# Altium project Creating and Using Design Reuse Block in a Workspace - Brendan Cook.PrjPcb (part 1 of 2)
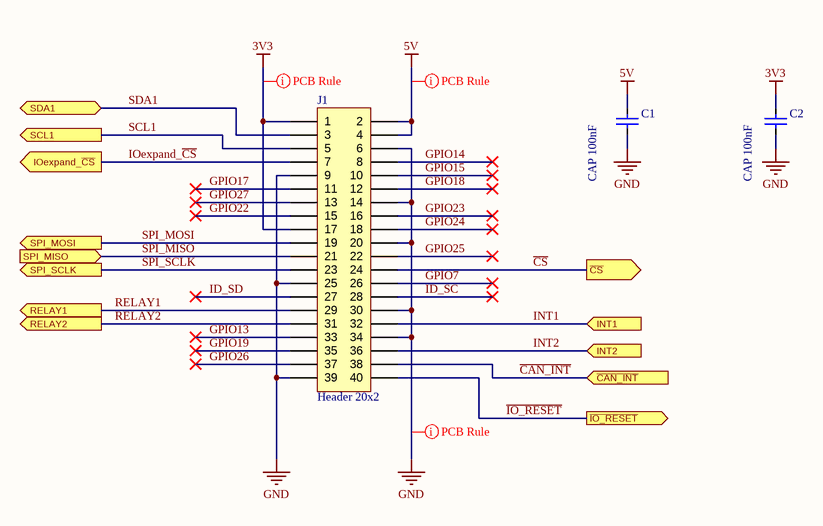
[diagram p0:  Processor_Interface.SchDoc]
 Altium Department: Altium Training Department;  Altium Training: Altium Designer Essentials Training Course - A365;  Altium Training Module: Module [--] / [Title];  CAGE_CODE: -----;  CONTRACT_NUMBER: <CONTRACT NO>;  DOC_NO_ASSY_DWG: <ASSY DWG NO>;  DOC_NO_BOM: <BOM DOC NO>;  DOC_NO_FAB_DWG: <FAB DWG NO>;  DOC_NO_SCH_DWG: <SCH DWG NO>;  DRAFTSMAN_ASSEMBLY_SCALE: 1:1;  DRAFTSMAN_FABRICATION_SCALE: 1:1;  PCB_2_DEC_TOL: +/-.01;  PCB_3_DEC_TOL: +/-.010;  PCB_ANG_TOL: +/-1/2;  PCB_ASSEMBLY_NO: <PCB ASSY NO>;  PCB_CHECKER: - -----;  PCB_CHECKER_APP_DATE: --/--/----;  PCB_DESIGNER: - -----;  PCB_DESIGNER_APP_DATE: --/--/----;  PCB_DWG_NO: A-ET-A365-001;  PCB_ENGINEER: - -----;  PCB_ENGINEER_APP_DATE: --/--/----;  PCB_PART_NUMBER: <PCB PN>;  PCB_REV: 1.0;  PCB_SCALE: NONE;  PCB_TITLE_1: <TITLE 1>;  PCB_TITLE_2: <TITLE 2>;  Project_Name: WC Topping;  SCH_CHECKER: - -----;  SCH_CHECKER_APP_DATE: --/--/----;  SCH_DESIGNER: - -----;  SCH_DESIGNER_APP_DATE: --/--/----;  SCH_ENGINEER: - -----;  SCH_ENGINEER_APP_DATE: --/--/----;  SCH_REV: A
8 sheets, 53 parts. Net scope: hierarchical (ports join the sheet entries above them; power ports are global).
Board file:  Creating and Using Design Reuse Block in a Workspace.PcbDoc
Sheets:
   Processor_Interface.SchDoc
   IO Logic Block.SchDoc
   Processor_Power.SchDoc
   CAN_Interface.SchDoc
   Digital_ IO.SchDoc
   Relay_IO.SchDoc
   Top_Level.SchDoc
   Power Supply.SchDoc

## Sheet  Processor_Interface.SchDoc
size 431 x 279 mm; Organization: ORGANIZATION; Address1: ADDRESS 1; Address2: ADDRESS 2; Address3: ADDRESS 3; Address4: ADDRESS 4; Revision: -; SheetNumber: 7; SheetTotal: 8; ENG_APP_DATE: --/--/--; DSN_APP_DATE: --/--/--; CHK_APP_DATE: --/--/--

### Parts
C1  CAP 100nF  [0603C_L]
C2  CAP 100nF  [0603C_L]
J1  Header 20x2  [HDR2X20]

### Ports
INT1 (in), INT2 (in), IOexpand_~{CS} (out), RELAY1 (out), RELAY2 (out), SCL1 (out), SDA1 (bidir), SPI_MISO (in), SPI_MOSI (out), SPI_SCLK (out), ~{CAN_INT} (in), ~{CS} (out), ~{IO_RESET} (out)

### Nets
3V3: C2.2 J1.1 J1.17
5V: C1.2 J1.2 J1.4
GND: C1.1 C2.1 J1.6 J1.9 J1.14 J1.20 J1.25 J1.30 J1.34 J1.39
~{CAN_INT}: J1.38 ; port ~{CAN_INT}
~{IO_RESET}: J1.40 ; port ~{IO_RESET}
~{CS}: J1.24 ; port ~{CS}
GPIO7: J1.26
GPIO13: J1.33
GPIO14: J1.8
GPIO15: J1.10
GPIO17: J1.11
GPIO18: J1.12
GPIO19: J1.35
GPIO22: J1.15
GPIO23: J1.16
GPIO24: J1.18
GPIO25: J1.22
GPIO26: J1.37
GPIO27: J1.13
ID_SC: J1.28
ID_SD: J1.27
INT1: J1.32 ; port INT1
INT2: J1.36 ; port INT2
IOexpand_~{CS}: J1.7 ; port IOexpand_~{CS}
RELAY1: J1.29 ; port RELAY1
RELAY2: J1.31 ; port RELAY2
SCL1: J1.5 ; port SCL1
SDA1: J1.3 ; port SDA1
SPI_MISO: J1.21 ; port SPI_MISO
SPI_MOSI: J1.19 ; port SPI_MOSI
SPI_SCLK: J1.23 ; port SPI_SCLK

### Layout directives
net class Power; rule Width Constraint [Pref Width = 30mil    Min Width = 10mil    Max Width = 100mil]: 3V3, 5V, GND

### Notes on the sheet
- DWG. NO.
- REV.
- SHT.
- THIS DOCUMENT AND THE DATA DISCLOSED HEREIN OR HEREWITH IS THE PROPERTY OF ALTIUM LIMITED AND MAY BE FREELY DISTRIBUTED IN WHOLE. NO RIGHTS ARE RESERVED OR EXPRESS OR IMPLIED WARANTEE GIVEN.
- REVISION
- DESCRIPTION
- DATE
- APPROVED
- ENG:
- DSN:
- APPROVALS
- PROJECT REVISION:
- www.altium.com <http://www.altium.com>
- DOCUMENT REVISION:
- 92037, La Jolla
- USA
- Altium Ltd.
- 4225 Executive Square
- CHK:
- REFERENCE DOCUMENTS
- DESIGN ITEM:
- TITLE
- VARIANT
- BOM:
- FAB DWG:
- PCB DWG:
- ASSY DWG:
- SCALE:
- SIZE
- B
- CAGE CODE
- FILE NAME
- DWG NO.
- SHEET
- OF
- REV

### Library data of the parts
C1 C2 = CMP-001-00091-2: Ceramic Capacitor, Multilayer, Ceramic, 50V, 80% +Tol, 20% -Tol, Y5V, -82/+22% TC, 0.1uF, Surface Mount, 0603; Manufacturer: Yageo; Manufacturer Part Number: CC0603ZRY5V9BB104; Multilayer: Yes; Packaging: Tape and Reel; Case/Package: 0603; Dielectric Material: Ceramic; Height: 0.8mm; Length: 1.6mm; Max Operating Temperature: 85°C; Min Operating Temperature: -30°C; Mounting Technology: Surface Mount; Pins: 2; RoHS Compliant: Yes; Termination: Wraparound; Value: 100nF; Voltage Rating: 50V; Width: 0.8mm; Capacitor Type: Ceramic; JESD-609 Code: e3; Package Shape: Rectangular; Package Style: SMTMeter; Rated DC Voltage (URdc): 50V; Reach SVHC Compliant: Yes; Temperature Characteristics Code: Y5V; Terminal Finish: Nickel; Tolerance  (fill in as +-): 20%; Tolerance (fill in as +-): 80%; Component Type: Capacitors; Design Item ID: CMP-00119-2; Source: WCTopping - Master Project 2023-08-21.SCHLIB
J1 = CMP-002-00076-2: Header, 20-Pin, Dual row; LatestRevisionDate: 17-Jul-2002; LatestRevisionNote: Re-released for DXP Platform.; Publisher: Altium Limited; Design Item ID: Header 20X2; Source: WCT.SchLib; Component Type: Connectors; Pins: 40

## Sheet  IO Logic Block.SchDoc
size 431 x 279 mm; Organization: ORGANIZATION; Address1: ADDRESS 1; Address2: ADDRESS 2; Address3: ADDRESS 3; Address4: ADDRESS 4; Revision: -; SheetNumber: 2; SheetTotal: 8; ENG_APP_DATE: --/--/--; DSN_APP_DATE: --/--/--; CHK_APP_DATE: --/--/--
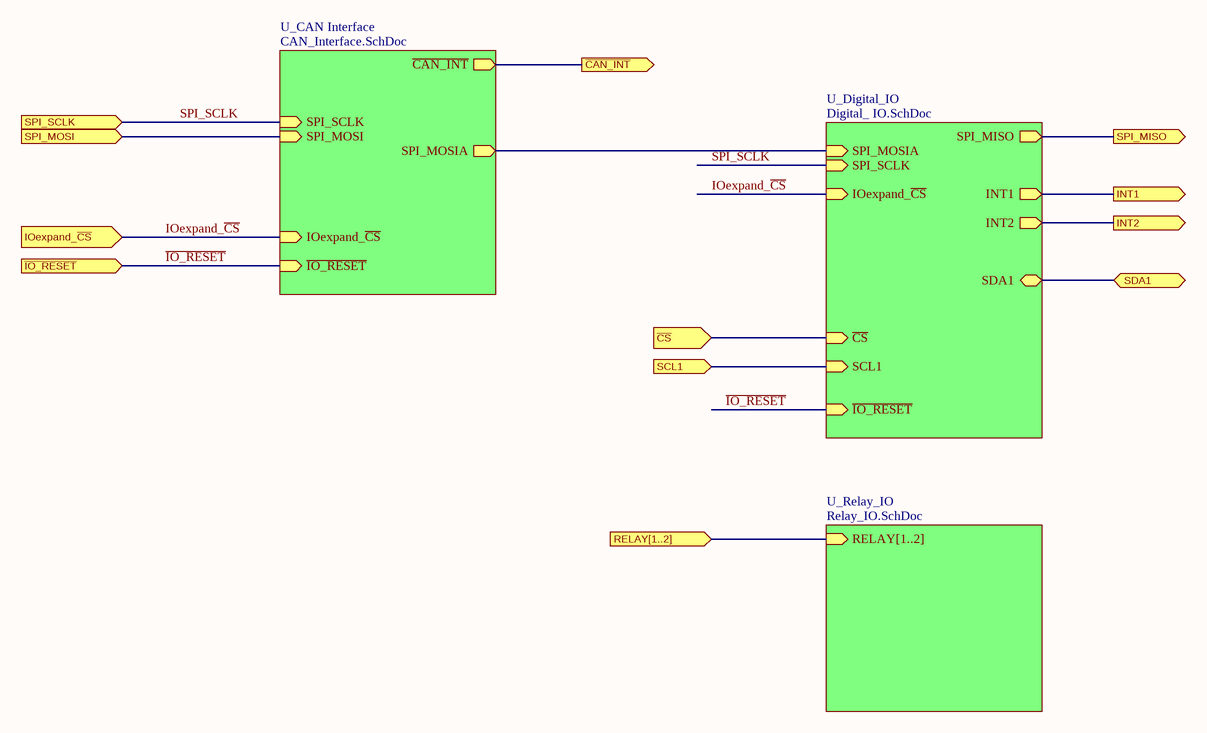
[diagram p1:  IO Logic Block.SchDoc]

### Sub-sheets
U_CAN Interface = CAN_Interface.SchDoc (file not in this document): ~{CAN_INT} (out), SPI_SCLK (in), SPI_MOSI (in), SPI_MOSIA (out), ~{IO_RESET} (in), IOexpand_~{CS} (in)
U_Digital_IO = Digital_ IO.SchDoc (file not in this document): IOexpand_~{CS} (in), SPI_SCLK (in), SPI_MOSIA (in), SPI_MISO (out), ~{IO_RESET} (in), INT1 (out), INT2 (out), ~{CS} (in), SDA1 (bidir), SCL1 (in)
U_Relay_IO = Relay_IO.SchDoc (file not in this document): RELAY[1..2] (in)

### Ports
INT1 (out), INT2 (out), IOexpand_~{CS} (in), RELAY[1..2] (in), SCL1 (in), SDA1 (bidir), SPI_MISO (out), SPI_MOSI (in), SPI_SCLK (in), ~{CAN_INT} (out), ~{CS} (in), ~{IO_RESET} (in)

### Nets
~{IO_RESET}: port ~{IO_RESET}, sheet U_Digital_IO/~{IO_RESET}, sheet U_CAN Interface/~{IO_RESET}
IOexpand_~{CS}: port IOexpand_~{CS}, sheet U_Digital_IO/IOexpand_~{CS}, sheet U_CAN Interface/IOexpand_~{CS}
SPI_SCLK: port SPI_SCLK, sheet U_Digital_IO/SPI_SCLK, sheet U_CAN Interface/SPI_SCLK
(unnamed): port ~{CAN_INT}, sheet U_CAN Interface/~{CAN_INT}
(unnamed): port SPI_MOSI, sheet U_CAN Interface/SPI_MOSI
(unnamed): port SPI_MISO, sheet U_Digital_IO/SPI_MISO
(unnamed): port INT1, sheet U_Digital_IO/INT1
(unnamed): port INT2, sheet U_Digital_IO/INT2
(unnamed): port SDA1, sheet U_Digital_IO/SDA1
(unnamed): port SCL1, sheet U_Digital_IO/SCL1
(unnamed): port ~{CS}, sheet U_Digital_IO/~{CS}
(unnamed): sheet U_Digital_IO/SPI_MOSIA, sheet U_CAN Interface/SPI_MOSIA

### Buses and harness runs
bus port RELAY[1..2] = sheet U_Relay_IO/RELAY[1..2]

### Notes on the sheet
- DWG. NO.
- REV.
- SHT.
- THIS DOCUMENT AND THE DATA DISCLOSED HEREIN OR HEREWITH IS THE PROPERTY OF ALTIUM LIMITED AND MAY BE FREELY DISTRIBUTED IN WHOLE. NO RIGHTS ARE RESERVED OR EXPRESS OR IMPLIED WARANTEE GIVEN.
- REVISION
- DESCRIPTION
- DATE
- APPROVED
- ENG:
- DSN:
- APPROVALS
- PROJECT REVISION:
- www.altium.com <http://www.altium.com>
- DOCUMENT REVISION:
- 92037, La Jolla
- USA
- Altium Ltd.
- 4225 Executive Square
- CHK:
- REFERENCE DOCUMENTS
- DESIGN ITEM:
- TITLE
- VARIANT
- BOM:
- FAB DWG:
- PCB DWG:
- ASSY DWG:
- SCALE:
- SIZE
- B
- CAGE CODE
- FILE NAME
- DWG NO.
- SHEET
- OF
- REV

## Sheet  Processor_Power.SchDoc
size 431 x 279 mm; Organization: ORGANIZATION; Address1: ADDRESS 1; Address2: ADDRESS 2; Address3: ADDRESS 3; Address4: ADDRESS 4; Revision: -; SheetNumber: 6; SheetTotal: 8; ENG_APP_DATE: --/--/--; DSN_APP_DATE: --/--/--; CHK_APP_DATE: --/--/--
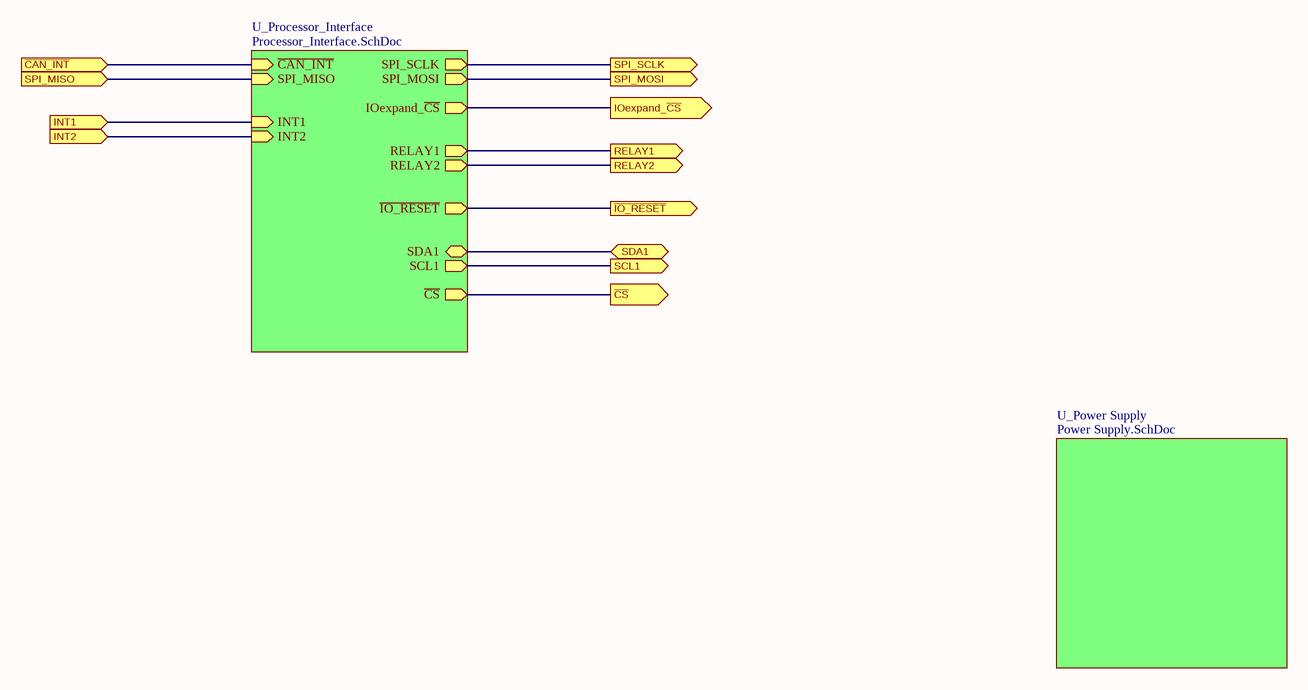
[diagram p2:  Processor_Power.SchDoc]

### Sub-sheets
U_Power Supply = Power Supply.SchDoc (file not in this document): no entries
U_Processor_Interface = Processor_Interface.SchDoc (file not in this document): ~{CAN_INT} (in), SPI_SCLK (out), SPI_MOSI (out), SPI_MISO (in), IOexpand_~{CS} (out), RELAY1 (out), RELAY2 (out), INT1 (in), INT2 (in), ~{IO_RESET} (out), SDA1 (bidir), SCL1 (out), ~{CS} (out)

### Ports
INT1 (in), INT2 (in), IOexpand_~{CS} (out), RELAY1 (out), RELAY2 (out), SCL1 (out), SDA1 (bidir), SPI_MISO (in), SPI_MOSI (out), SPI_SCLK (out), ~{CAN_INT} (in), ~{CS} (out), ~{IO_RESET} (out)

### Nets
(unnamed): port SDA1, sheet U_Processor_Interface/SDA1
(unnamed): port SCL1, sheet U_Processor_Interface/SCL1
(unnamed): port IOexpand_~{CS}, sheet U_Processor_Interface/IOexpand_~{CS}
(unnamed): port SPI_MOSI, sheet U_Processor_Interface/SPI_MOSI
(unnamed): port SPI_MISO, sheet U_Processor_Interface/SPI_MISO
(unnamed): port SPI_SCLK, sheet U_Processor_Interface/SPI_SCLK
(unnamed): port ~{CS}, sheet U_Processor_Interface/~{CS}
(unnamed): port RELAY1, sheet U_Processor_Interface/RELAY1
(unnamed): port INT1, sheet U_Processor_Interface/INT1
(unnamed): port RELAY2, sheet U_Processor_Interface/RELAY2
(unnamed): port INT2, sheet U_Processor_Interface/INT2
(unnamed): port ~{IO_RESET}, sheet U_Processor_Interface/~{IO_RESET}
(unnamed): port ~{CAN_INT}, sheet U_Processor_Interface/~{CAN_INT}

### Notes on the sheet
- DWG. NO.
- REV.
- SHT.
- THIS DOCUMENT AND THE DATA DISCLOSED HEREIN OR HEREWITH IS THE PROPERTY OF ALTIUM LIMITED AND MAY BE FREELY DISTRIBUTED IN WHOLE. NO RIGHTS ARE RESERVED OR EXPRESS OR IMPLIED WARANTEE GIVEN.
- REVISION
- DESCRIPTION
- DATE
- APPROVED
- ENG:
- DSN:
- APPROVALS
- PROJECT REVISION:
- www.altium.com <http://www.altium.com>
- DOCUMENT REVISION:
- 92037, La Jolla
- USA
- Altium Ltd.
- 4225 Executive Square
- CHK:
- REFERENCE DOCUMENTS
- DESIGN ITEM:
- TITLE
- VARIANT
- BOM:
- FAB DWG:
- PCB DWG:
- ASSY DWG:
- SCALE:
- SIZE
- B
- CAGE CODE
- FILE NAME
- DWG NO.
- SHEET
- OF
- REV

## Sheet  CAN_Interface.SchDoc
size 431 x 279 mm; Organization: ORGANIZATION; Address1: ADDRESS 1; Address2: ADDRESS 2; Address3: ADDRESS 3; Address4: ADDRESS 4; Revision: -; SheetNumber: 3; SheetTotal: 8; ENG_APP_DATE: --/--/--; DSN_APP_DATE: --/--/--; CHK_APP_DATE: --/--/--
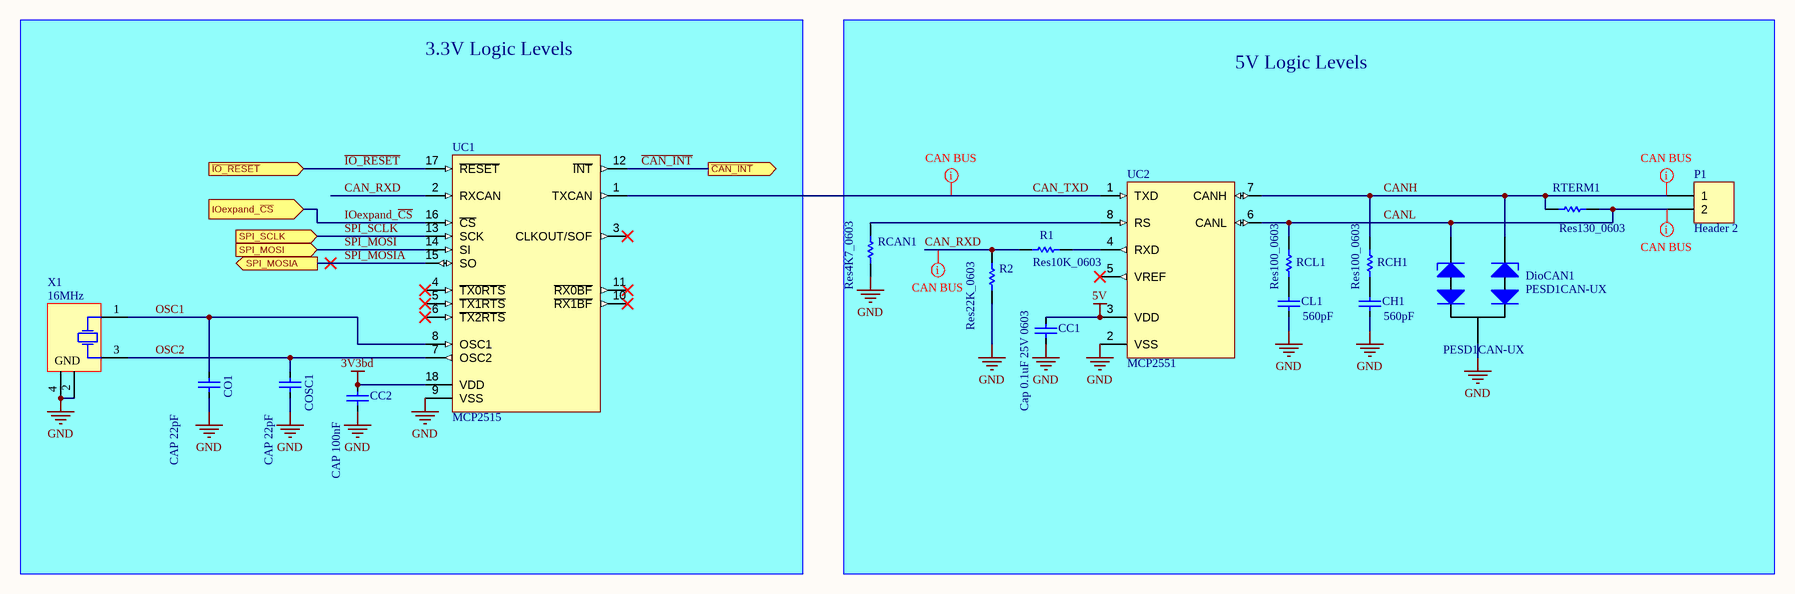
[diagram p3:  CAN_Interface.SchDoc]

### Parts
CC1  Cap 0.1uF 25V 0603  [0603C_L]
CC2  CAP 100nF  [0603C_L]
CH1  value 560pF  [0603C_L]  (hidden comment: 560pF 25V 0603)
CL1  value 560pF  [0603C_L]  (hidden comment: 560pF 25V 0603)
CO1  CAP 22pF  [0603C_L]
COSC1  CAP 22pF  [0603C_L]
DioCAN1  PESD1CAN-UX  [SOT323]
P1  Header 2  [HDR1X2]
R1  Res10K_0603  [0603_L]
R2  Res22K_0603  [0603_L]
RCAN1  Res4K7_0603  [0603_L]
RCH1  Res100_0603  [0603_L]
RCL1  Res100_0603  [0603_L]
RTERM1  Res130_0603  [0603_L]
UC1  MCP2515  [SOIC-SO18_M]
UC2  MCP2551  [SOIC-SN8_N]
X1  Frequency: 16MHz  [FP-ABM8-MFG]  (hidden comment: Crystal 4Pin)

### Blocks framed on the sheet
3.3V Logic Levels: CC2 CO1 COSC1 UC1 X1
5V Logic Levels: CC1 CH1 CL1 DioCAN1 P1 R1 R2 RCAN1 RCH1 RCL1 RTERM1 UC2

### Ports
IOexpand_~{CS} (in), SPI_MOSI (in), SPI_MOSIA (out), SPI_SCLK (in), ~{CAN_INT} (out), ~{IO_RESET} (in)

### Nets
3V3bd: CC2.2 UC1.18(VDD)
5V: CC1.2 UC2.3(VDD)
GND: CC1.1 CC2.1 CH1.2 CL1.1 CO1.1 COSC1.1 DioCAN1.3 R2.1 RCAN1.1 UC1.9(VSS) UC2.2(VSS) X1.2(GND) X1.4(GND)
~{CAN_INT}: UC1.12(~{INT}) ; port ~{CAN_INT}
~{IO_RESET}: UC1.17(~{RESET}) ; port ~{IO_RESET}
CAN_RXD: R1.2 R2.2 UC1.2(RXCAN)
CAN_TXD: UC1.1(TXCAN) UC2.1(TXD)
CANH: DioCAN1.1(A) P1.1 RCH1.2 RTERM1.2 UC2.7(CANH)
CANL: DioCAN1.2(K) P1.2 RCL1.2 RTERM1.1 UC2.6(CANL)
IOexpand_~{CS}: UC1.16(~{CS}) ; port IOexpand_~{CS}
OSC1: CO1.2 UC1.8(OSC1) X1.1
OSC2: COSC1.2 UC1.7(OSC2) X1.3
SPI_MOSI: UC1.14(SI) ; port SPI_MOSI
SPI_MOSIA: UC1.15(SO) ; port SPI_MOSIA
SPI_SCLK: UC1.13(SCK) ; port SPI_SCLK
NetCH1_1: CH1.1 RCH1.1
NetCL1_2: CL1.2 RCL1.1
NetR1_1: R1.1 UC2.4(RXD)
NetRCAN1_2: RCAN1.2 UC2.8(RS)

Not connected (* = marked no-connect by the designer): UC1 3(CLKOUT/SOF)* 4(~{TX0RTS})* 5(~{TX1RTS})* 6(~{TX2RTS})* 10(~{RX1BF})* 11(~{RX0BF})*; UC2 5(VREF)*

### Layout directives
net class CAN_Bus; rule Width Constraint [Pref Width = 20mil    Min Width = 10mil    Max Width = 30mil]; rule Clearance Constraint [Clearance = 15mil]: CAN_RXD, CAN_TXD, CANH, CANL

### Notes on the sheet
- DWG. NO.
- REV.
- SHT.
- THIS DOCUMENT AND THE DATA DISCLOSED HEREIN OR HEREWITH IS THE PROPERTY OF ALTIUM LIMITED AND MAY BE FREELY DISTRIBUTED IN WHOLE. NO RIGHTS ARE RESERVED OR EXPRESS OR IMPLIED WARANTEE GIVEN.
- REVISION
- DESCRIPTION
- DATE
- APPROVED
- ENG:
- DSN:
- APPROVALS
- PROJECT REVISION:
- www.altium.com <http://www.altium.com>
- DOCUMENT REVISION:
- 92037, La Jolla
- USA
- Altium Ltd.
- 4225 Executive Square
- CHK:
- REFERENCE DOCUMENTS
- DESIGN ITEM:
- TITLE
- VARIANT
- BOM:
- FAB DWG:
- PCB DWG:
- ASSY DWG:
- SCALE:
- SIZE
- B
- CAGE CODE
- FILE NAME
- DWG NO.
- SHEET
- OF
- REV

### Library data of the parts
CC1 = CMP-022-000000-2: Cap0.1uF_25V_0603; Value: 100nF; Case/Package: 0603; Voltage Rating: 25V; Component Type: Capacitors; Design Item ID: CMP-00001-1; Pin Count: 2; Source: WCTopping - Master Project 2023-08-21.SCHLIB
CC2 = CMP-001-00091-2: as C1 on sheet  Processor_Interface; Case/Package: 0603; Dielectric Material: Ceramic; Height: 0.8mm; Length: 1.6mm; Max Operating Temperature: 85°C; Min Operating Temperature: -30°C; Mounting Technology: Surface Mount; Packaging: Tape and Reel; Pins: 2; RoHS Compliant: Yes; Termination: Wraparound; Value: 100nF; Voltage Rating: 50V; Width: 0.8mm; Capacitor Type: Ceramic; JESD-609 Code: e3; Package Shape: Rectangular; Package Style: SMTMeter; Rated DC Voltage (URdc): 50V; Reach SVHC Compliant: Yes; Temperature Characteristics Code: Y5V; Terminal Finish: Nickel; Tolerance  (fill in as +-): 20%; Tolerance (fill in as +-): 80%; Component Type: Capacitors; Design Item ID: CMP-00119-2; Source: WCTopping - Master Project 2023-08-21.SCHLIB
CH1 CL1 = CMP-001-00092-4: Case/Package: 0603; Pins: 2; Voltage Rating: 25V; Component Type: Standard; Design Item ID: CMP-00212-1; Source: Components - 10.07.24 - 08.39a.SchLib
CO1 COSC1 = CMP-001-00088-2: Ceramic Capacitor, Multilayer, Ceramic, 50V, 5% +Tol, 5% -Tol, C0G, 30ppm/Cel TC, 0.000022uF, Surface Mount, 0603; Manufacturer: Murata; Manufacturer Part Number: GRM1885C1H220JA01D; Multilayer: Yes; Case/Package: 0603; Pins: 2; Min Operating Temperature: -55°C; Max Operating Temperature: 125°C; Voltage Rating: 50V; Tolerance: 5%; Packaging: Tape and Reel; Length: 1.6mm; Height: 0.8mm; Width: 0.8mm; Dielectric Material: Ceramic; Mounting Technology: Surface Mount; RoHS Compliant: Yes; Termination: Wraparound; Value: 22pF; Capacitor Type: Ceramic; JESD-609 Code: e3; Package Shape: Rectangular; Package Style: SMTMeter; Rated DC Voltage (URdc): 50V; Reach SVHC Compliant: Yes; Temperature Characteristics Code: C0G; Terminal Finish: Nickel; Tolerance  (fill in as +-): 5%; Tolerance (fill in as +-): 5%; Component Type: Capacitors; Design Item ID: CMP-00026-1; Source: WCTopping - Master Project 2023-08-21.SCHLIB
DioCAN1 = CMP-004-00033-1: Trans Voltage Suppressor Diode, 150W, 24V V(RWM), Bidirectional, 2 Element, Silicon; Manufacturer: Nexperia; Diode Type: Fast Recovery; Manufacturer Part Number: PESD1CAN-UX; Design Item ID: PESD1CAN-UX; Source: WCT.SchLib; Pins: 3; Component Type: Diodes
P1 = CMP-002-00072-2: Header, 2-Pin; LatestRevisionDate: 17-Jul-2002; LatestRevisionNote: Re-released for DXP Platform.; Publisher: Altium Limited; Design Item ID: Header 2; Source: WCT.SchLib; Component Type: Connectors; Pins: 2
R1 = CMP-009-00178-1: Manufacturer: Panasonic; Manufacturer Part Number: ERJ-3GEYJ102V; Resistance (Ohms): 10k; Tolerance: 5%; Power (Watts): 0.1W, 1/10W; Temperature Coefficient: ±200ppm/°C; RoHS: RoHS Compliant; Category: Resistors; Packaging: Cut Tape (CT); Part Status: Active; Composition: Thick Film; Features: Automotive AEC-Q200; Operating Temperature: -55°C ~ 155°C; Package / Case: 0603 (1608 Metric); Supplier Device Package: 0603; Size / Dimension: 0.063" L x 0.031" W (1.60mm x 0.80mm); Height: 0.022" (0.55mm); Number of Terminations: 2; Failure Rate: -; Design Item ID: Res10K_0603; Source: WCT.SchLib; Component Type: Resistors; Pins: 2
R2 = CMP-009-00177-1: RES22K 0.5% 0603; Manufacturer: Yageo; Manufacturer Part Number: RT0603DRD0722KL; Power Rating: 100 mW; Temperature Coefficient: 25 PPM / C; Voltage Rating: 75V; Unit Weight: 0.000071 oz; Value: 22k; Stock 1: 39729; Pricing 1: 1=0.12, 10=0.104, 25=0.0716, 50=0.0558, 100=0.0399, 250=0.0311, 500=0.0247, 1000=0.0175 (USD); Product Category: Thin Film Resistors - SMD; RoHS: True; Tolerance: 0.5%; Operating Temperature Range: - 55 C to + 125 C; Series: RT; Packaging: Reel; Brand: Yageo; Height: 0.45 mm; Length: 1.6 mm; Package / Case: 0603 (1608 metric); Product: Thin Film Resistors SMD; Termination Style: SMD/SMT; Type: High Precision, High Stability; Width: 0.8 mm; ComponentLink1URL: https://datasheet.ciiva.com/12810/pyu-rt-1-to-0-05-rohs-l-4-12810773.pdf; ComponentLink1Description: https://datasheet.ciiva.com/12810/pyu-rt-1-to-0-05-rohs-l-4-12810773.pdf; Case/Package: 1608; Design Item ID: Res22K_0603; Source: WCT.SchLib; Component Type: Resistors; Pins: 2
RCAN1 = CMP-022-000001-1: Manufacturer: Yageo; Manufacturer Part Number: RT0603DRD074K99L; Resistance (Ohms): 4.7k; Tolerance: 0.5%; Power (Watts): 0.1W, 1/10W; Temperature Coefficient: ±25ppm/°C; RoHS: RoHS Compliant; Category: Resistors; Stock 1: 28874; Pricing 1: 1=0.22, 10=0.184, 25=0.134, 100=0.0721, 250=0.05532, 500=0.04358, 1000=0.03018, 2500=0.02766 (USD); Packaging: Cut Tape (CT); Part Status: Active; Composition: Thin Film; Features: Moisture Resistant; Operating Temperature: -55°C ~ 155°C; Package / Case: 0603 (1608 Metric); Supplier Device Package: 0603; Size / Dimension: 0.063" L x 0.031" W (1.60mm x 0.80mm); Height: 0.022" (0.55mm); Number of Terminations: 2; Failure Rate: -; ComponentLink1URL: http://www.yageo.com/documents/recent/PYu-RT_1-to-0.05_RoHS_L_6.pdf; ComponentLink1Description: http://www.yageo.com/documents/recent/PYu-RT_1-to-0.05_RoHS_L_6.pdf; Design Item ID: Res4K7_0603; Source: WCT.SchLib; Component Type: Resistors; Pin Count: 2
RCH1 RCL1 = CMP-022-000002-1: Manufacturer: Panasonic Electronic Components; Resistance (Ohms): 100; Tolerance: 5%; Power (Watts): 0.1W, 1/10W; Temperature Coefficient: ±200ppm/°C; RoHS: RoHS Compliant; Category: Resistors; Stock 1: 1335381; Pricing 1: 1=0.1, 50=0.0096, 100=0.0071, 250=0.00544, 500=0.00436, 1000=0.00321 (USD); Packaging: Cut Tape (CT); Part Status: Active; Composition: Thick Film; Features: Automotive AEC-Q200; Operating Temperature: -55°C ~ 155°C; Package / Case: 0603 (1608 Metric); Supplier Device Package: 0603; Size / Dimension: 0.063" L x 0.031" W (1.60mm x 0.80mm); Height: 0.022" (0.55mm); Number of Terminations: 2; Failure Rate: -; ComponentLink1URL: http://industrial.panasonic.com/www-cgi/jvcr13pz.cgi?E+PZ+3+AOA0001+ERJ3GEYJ102V+7+WW; ComponentLink1Description: http://industrial.panasonic.com/www-cgi/jvcr13pz.cgi?E+PZ+3+AOA0001+ERJ3GEYJ102V+7+WW; Design Item ID: Res100_0603; Source: WCT.SchLib; Component Type: Resistors; Pin Count: 2
RTERM1 = CMP-022-000008-1: Manufacturer: Panasonic Electronic Components; Resistance (Ohms): 100; Tolerance: 5%; Power (Watts): 0.1W, 1/10W; Temperature Coefficient: ±200ppm/°C; RoHS: RoHS Compliant; Category: Resistors; Stock 1: 1335381; Pricing 1: 1=0.1, 50=0.0096, 100=0.0071, 250=0.00544, 500=0.00436, 1000=0.00321 (USD); Packaging: Cut Tape (CT); Part Status: Active; Composition: Thick Film; Features: Automotive AEC-Q200; Operating Temperature: -55°C ~ 155°C; Package / Case: 0603 (1608 Metric); Supplier Device Package: 0603; Size / Dimension: 0.063" L x 0.031" W (1.60mm x 0.80mm); Height: 0.022" (0.55mm); Number of Terminations: 2; Failure Rate: -; ComponentLink1URL: http://industrial.panasonic.com/www-cgi/jvcr13pz.cgi?E+PZ+3+AOA0001+ERJ3GEYJ102V+7+WW; ComponentLink1Description: http://industrial.panasonic.com/www-cgi/jvcr13pz.cgi?E+PZ+3+AOA0001+ERJ3GEYJ102V+7+WW; Design Item ID: Res130_0603; Source: WCT.SchLib; Component Type: Resistors; Pin Count: 2
UC1 = CMP-022-000006-2: Stand-Alone CAN Controller With SPI Interface, 18-Pin SOIC, Extended Temperature; Manufacturer: Microchip; Manufacturer Part Number: MCP2515-E/SO; Available Preview Images: 2D; RevisionNote: URLs added. DatasheetVersion updated.; DatasheetVersion: revF, Oct-2010; ComponentLink2Description: Datasheet; ComponentLink3Description: Package Specification; ComponentLink1Description: Manufacturer URL; PackageReference: SOIC-SO18; PackageDescription: 18-Lead Plastic Small Outline (SO) - Wide 7.50mm Body [SOIC]; PackageVersion: revBB, Aug-2009; ComponentLink1URL: http://www.microchip.com/; ComponentLink3URL: http://www.microchip.com/stellent/groups/techpub_sg/documents/packagingspec/en012702.pdf; ComponentLink2URL: http://ww1.microchip.com/downloads/en/DeviceDoc/21801f.pdf; Code_JEDEC: MS-013; Design Item ID: MCP2515-E/SO; Source: WCT.SchLib; Component Type: Integrated Circuits; Pin Count: 18
UC2 = CMP-022-000009-2: High-Speed CAN Transceiver, 8-Pin SOIC, Extended Temperature; Manufacturer: Microchip; Manufacturer Part Number: MCP2551-E/SN; Available Preview Images: 2D; PackageReference: SOIC-SN8; Code_JEDEC: MS-012; ComponentLink1Description: Manufacturer URL; ComponentLink1URL: http://www.microchip.com/; PackageVersion: revBB, Aug-2009; ComponentLink3Description: Package Specification; Code_IPC: SOIC127P600-8; ComponentLink2URL: http://ww1.microchip.com/downloads/en/DeviceDoc/21667F.pdf; RevisionNote: URLs added. DatasheetVersion updated.; ComponentLink3URL: http://www.microchip.com/stellent/groups/techpub_sg/documents/packagingspec/en012702.pdf; DatasheetVersion: revF, Jul-2010; ComponentLink2Description: Datasheet; PackageDescription: 8-Lead Plastic Small Outline (SN) - Narrow, 3.90mm Body [SOIC]; Design Item ID: MCP2551-E/SN; Source: WCT.SchLib; Component Type: Integrated Circuits; Pin Count: 8
X1 = CMP-003-00030-2: Crystal 16MHz ±20ppm 18pF SMD-4 3.2mm x 2.5mm CSTCE16M0V53-R0 ABM8-16.000MHZ-B2-T; Manufacturer: Murata; Series Resistance: 70R; ESR (Equivalent Series Resistance): 70; Frequency Stability: 50ppm; Tolerance: 20ppm; Max Operating Temperature: 70°C; Operating Frequency: 16MHz; Height: 0.031inch; REACH SVHC: No SVHC; Depth: 2.5mm; Package Quantity: 1000; Series: ABM8; Termination: SMD/SMT; Load Capacitance: 18pF; Frequency Tolerance: 20ppm; Min Operating Temperature: -20°C; Length: 3.2mm; Width: 2.5mm; Lead Free: Lead Free; Resistor Type: Ceramic; Radiation Hardening: No; Mount: Surface Mount; RoHS Compliant: Yes; Case/Package: CSMD; Packaging: Tape and Reel; Design Item ID: ABM8-16.000MHZ-B2-T; Manufacturer Part Number: CSTCE16M0V53-R0; Pins: 4; Source: WCT.SchLib; Component Type: Crystals & Oscillators

## Sheet  Digital_ IO.SchDoc
size 431 x 279 mm; Organization: ORGANIZATION; Address1: ADDRESS 1; Address2: ADDRESS 2; Address3: ADDRESS 3; Address4: ADDRESS 4; Revision: -; SheetNumber: 4; SheetTotal: 8; ENG_APP_DATE: --/--/--; DSN_APP_DATE: --/--/--; CHK_APP_DATE: --/--/--
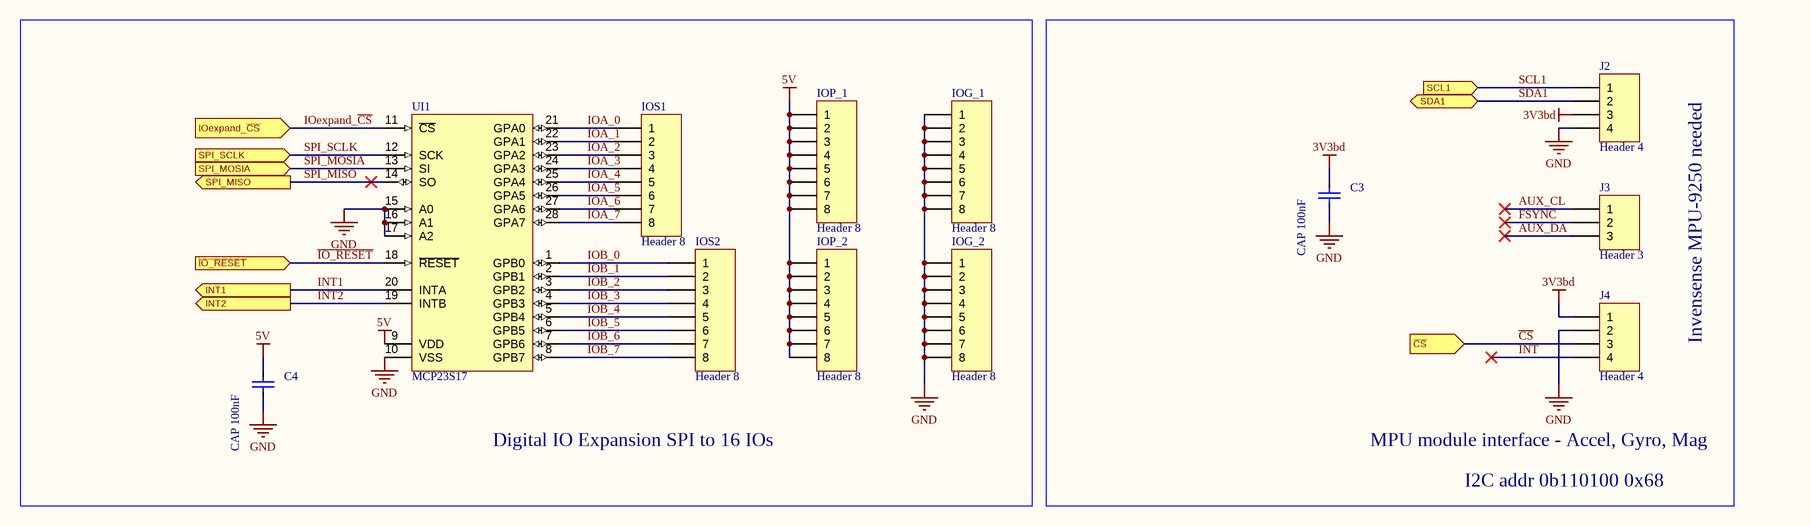
[diagram p4:  Digital_ IO.SchDoc]

### Parts
C3  CAP 100nF  [0603C_L]
C4  CAP 100nF  [0603C_L]
IOG_1  Header 8  [HDR1X8]
IOG_2  Header 8  [HDR1X8]
IOP_1  Header 8  [HDR1X8]
IOP_2  Header 8  [HDR1X8]
IOS1  Header 8  [HDR1X8]
IOS2  Header 8  [HDR1X8]
J2  Header 4  [HDR1X4]
J3  Header 3  [HDR1X3]
J4  Header 4  [HDR1X4]
UI1  MCP23S17  [SOIC-SO28_L]

### Blocks framed on the sheet
Digital IO Expansion SPI to 16 IOs: C4 IOG_1 IOG_2 IOP_1 IOP_2 IOS1 IOS2 UI1

### Ports
INT1 (out), INT2 (out), IOexpand_~{CS} (in), SCL1 (in), SDA1 (bidir), SPI_MISO (out), SPI_MOSIA (in), SPI_SCLK (in), ~{CS} (in), ~{IO_RESET} (in)

### Nets
3V3bd: C3.2 J2.3 J4.1
5V: C4.2 IOP_1.1 IOP_1.2 IOP_1.3 IOP_1.4 IOP_1.5 IOP_1.6 IOP_1.7 IOP_1.8 IOP_2.1 IOP_2.2 IOP_2.3 IOP_2.4 IOP_2.5 IOP_2.6 IOP_2.7 IOP_2.8 UI1.9(VDD)
GND: C3.1 C4.1 IOG_1.1 IOG_1.2 IOG_1.3 IOG_1.4 IOG_1.5 IOG_1.6 IOG_1.7 IOG_1.8 IOG_2.1 IOG_2.2 IOG_2.3 IOG_2.4 IOG_2.5 IOG_2.6 IOG_2.7 IOG_2.8 J2.4 J4.2 UI1.10(VSS) UI1.15(A0) UI1.16(A1) UI1.17(A2)
~{IO_RESET}: UI1.18(~{RESET}) ; port ~{IO_RESET}
AUX_CL: J3.1
AUX_DA: J3.3
~{CS}: J4.3 ; port ~{CS}
FSYNC: J3.2
INT: J4.4
INT1: UI1.20(INTA) ; port INT1
INT2: UI1.19(INTB) ; port INT2
IOA_0: IOS1.1 UI1.21(GPA0)
IOA_1: IOS1.2 UI1.22(GPA1)
IOA_2: IOS1.3 UI1.23(GPA2)
IOA_3: IOS1.4 UI1.24(GPA3)
IOA_4: IOS1.5 UI1.25(GPA4)
IOA_5: IOS1.6 UI1.26(GPA5)
IOA_6: IOS1.7 UI1.27(GPA6)
IOA_7: IOS1.8 UI1.28(GPA7)
IOB_0: IOS2.1 UI1.1(GPB0)
IOB_1: IOS2.2 UI1.2(GPB1)
IOB_2: IOS2.3 UI1.3(GPB2)
IOB_3: IOS2.4 UI1.4(GPB3)
IOB_4: IOS2.5 UI1.5(GPB4)
IOB_5: IOS2.6 UI1.6(GPB5)
IOB_6: IOS2.7 UI1.7(GPB6)
IOB_7: IOS2.8 UI1.8(GPB7)
IOexpand_~{CS}: UI1.11(~{CS}) ; port IOexpand_~{CS}
SCL1: J2.1 ; port SCL1
SDA1: J2.2 ; port SDA1
SPI_MISO: UI1.14(SO) ; port SPI_MISO
SPI_MOSIA: UI1.13(SI) ; port SPI_MOSIA
SPI_SCLK: UI1.12(SCK) ; port SPI_SCLK

### Notes on the sheet
- Invensense MPU-9250 needed
- MPU module interface - Accel, Gyro, Mag
- I2C addr 0b110100 0x68
- DWG. NO.
- REV.
- SHT.
- THIS DOCUMENT AND THE DATA DISCLOSED HEREIN OR HEREWITH IS THE PROPERTY OF ALTIUM LIMITED AND MAY BE FREELY DISTRIBUTED IN WHOLE. NO RIGHTS ARE RESERVED OR EXPRESS OR IMPLIED WARANTEE GIVEN.
- REVISION
- DESCRIPTION
- DATE
- APPROVED
- ENG:
- DSN:
- APPROVALS
- PROJECT REVISION:
- www.altium.com <http://www.altium.com>
- DOCUMENT REVISION:
- 92037, La Jolla
- USA
- Altium Ltd.
- 4225 Executive Square
- CHK:
- REFERENCE DOCUMENTS
- DESIGN ITEM:
- TITLE
- VARIANT
- BOM:
- FAB DWG:
- PCB DWG:
- ASSY DWG:
- SCALE:
- SIZE
- B
- CAGE CODE
- FILE NAME
- DWG NO.
- SHEET
- OF
- REV

### Library data of the parts
C3 C4 = CMP-001-00091-2: as C1 on sheet  Processor_Interface; Packaging: Tape and Reel; Case/Package: 0603; Dielectric Material: Ceramic; Height: 0.8mm; Length: 1.6mm; Max Operating Temperature: 85°C; Min Operating Temperature: -30°C; Mounting Technology: Surface Mount; Pins: 2; RoHS Compliant: Yes; Termination: Wraparound; Value: 100nF; Voltage Rating: 50V; Width: 0.8mm; Capacitor Type: Ceramic; JESD-609 Code: e3; Package Shape: Rectangular; Package Style: SMTMeter; Rated DC Voltage (URdc): 50V; Reach SVHC Compliant: Yes; Temperature Characteristics Code: Y5V; Terminal Finish: Nickel; Tolerance  (fill in as +-): 20%; Tolerance (fill in as +-): 80%; Component Type: Capacitors; Design Item ID: CMP-00119-2; Source: WCTopping - Master Project 2023-08-21.SCHLIB
IOG_1 IOG_2 IOP_1 IOP_2 IOS1 IOS2 = CMP-002-00075-2: Header, 8-Pin; LatestRevisionDate: 17-Jul-2002; LatestRevisionNote: Re-released for DXP Platform.; Publisher: Altium Limited; Design Item ID: Header 8; Source: WCT.SchLib; Component Type: Connectors; Pins: 8
J2 J4 = CMP-002-00074-2: Header, 4-Pin; LatestRevisionDate: 17-Jul-2002; LatestRevisionNote: Re-released for DXP Platform.; Publisher: Altium Limited; Design Item ID: Header 4; Source: WCT.SchLib; Component Type: Connectors; Pins: 4
J3 = CMP-002-00073-2: Header, 3-Pin; LatestRevisionDate: 17-Jul-2002; LatestRevisionNote: Re-released for DXP Platform.; Publisher: Altium Limited; Design Item ID: Header 3; Source: WCT.SchLib; Component Type: Connectors; Pins: 3
UI1 = CMP-022-000004-2: 16-Bit I/O Expander with Serial Interface, 28-Pin SOIC, Extended Temperature, Tape and Reel; Manufacturer: Microchip; Manufacturer Part Number: MCP23S17T-E/SO; Available Preview Images: 2D; PackageDescription: 28-Lead Plastic Small Outline (SO) - Wide 7.50mm Body [SOIC]; ComponentLink1URL: http://www.microchip.com/; Code_JEDEC: MS-013; ComponentLink3URL: http://www.microchip.com/stellent/groups/techpub_sg/documents/packagingspec/en012702.pdf; DatasheetVersion: revB, Feb-2007; ComponentLink2URL: http://ww1.microchip.com/downloads/en/DeviceDoc/21952b.pdf; ComponentLink2Description: Datasheet; ComponentLink3Description: Package Specification; PackageReference: SOIC-SO28; RevisionNote: URLs added. Sch pin type corrected.; ComponentLink1Description: Manufacturer URL; PackageVersion: revBB, Aug-2009; Design Item ID: MCP23S17T-E/SO; Source: WCT.SchLib; Component Type: Integrated Circuits; Pin Count: 28

## Sheet  Relay_IO.SchDoc
size 431 x 279 mm; Organization: ORGANIZATION; Address1: ADDRESS 1; Address2: ADDRESS 2; Address3: ADDRESS 3; Address4: ADDRESS 4; Revision: -; SheetNumber: 5; SheetTotal: 8; ENG_APP_DATE: --/--/--; DSN_APP_DATE: --/--/--; CHK_APP_DATE: --/--/--
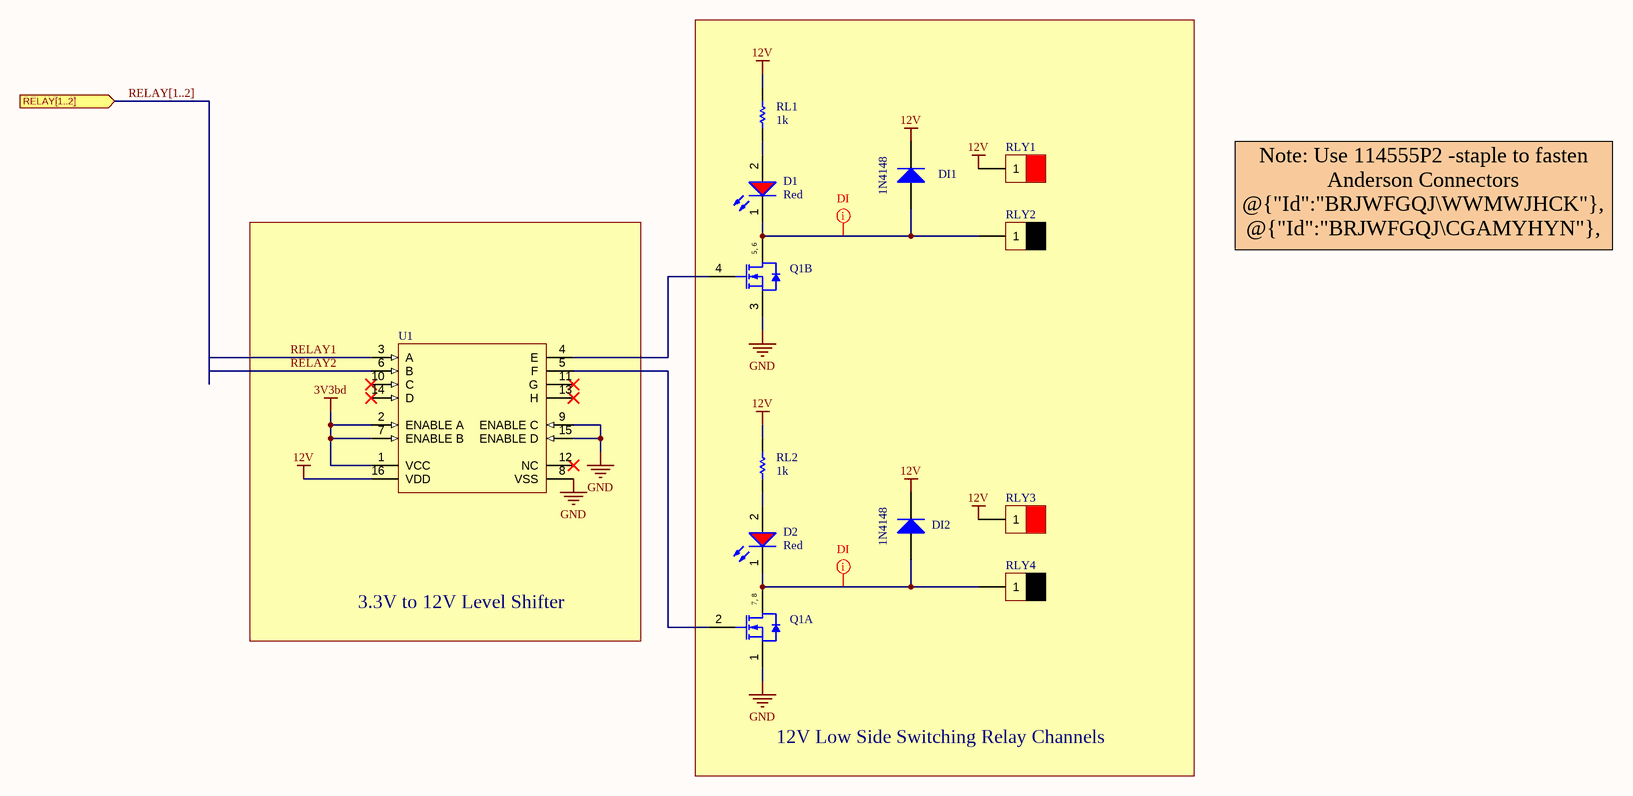
[diagram p5:  Relay_IO.SchDoc]

### Parts
D1  Color: Red  [0603_A]  (hidden comment: LED Red)
D2  Color: Red  [0603_A]  (hidden comment: LED Red)
DI1  1N4148  [DO-41]
DI2  1N4148  [DO-41]
Q1  NTHD4508NT1  [ONSC-CHIPFET-8-1206A-03_S2_V]  (value not drawn)  (parts A,B of 2)
RL1  Resistance (Ohms): 1k  [0805_L]  (hidden comment: Res1K_0805)
RL2  Resistance (Ohms): 1k  [0805_L]  (hidden comment: Res1K_0805)
RLY1  Anderson RED 1Pin  [Anderson_RED_RHT_BOT]  (value not drawn)
RLY2  Anderson Black 1Pin  [Anderson_BLK_RHT_BOT]  (value not drawn)
RLY3  Anderson RED 1Pin  [Anderson_RED_RHT_BOT]  (value not drawn)
RLY4  Anderson Black 1Pin  [Anderson_BLK_RHT_BOT]  (value not drawn)
U1  CD40109BPWR  [PW0016A_M]  (value not drawn)

### Blocks framed on the sheet
12V Low Side Switching Relay Channels: D1 D2 DI1 DI2 Q1 RL1 RL2 RLY1-RLY4
3.3V to 12V Level Shifter: U1

### Ports
RELAY[1..2] (in)

### Nets
3V3bd: U1.1(VCC) U1.2(ENABLE_A) U1.7(ENABLE_B)
12V: DI1.2(K) DI2.2(K) RL1.2 RL2.2 RLY1.1 RLY3.1 U1.16(VDD)
GND: Q1.1(S1) Q1.3(S2) U1.8(VSS) U1.9(ENABLE_C) U1.15(ENABLE_D)
RELAY1: U1.3(A)
RELAY2: U1.6(B)
NetD1_1: D1.1(K) DI1.1(A) Q1.5(D2) Q1.6(D2) RLY2.1
NetD1_2: D1.2(A) RL1.1
NetD2_1: D2.1(K) DI2.1(A) Q1.7(D1) Q1.8(D1) RLY4.1
NetD2_2: D2.2(A) RL2.1
NetQ1_2: Q1.2(G1) U1.5(F)
NetQ1_4: Q1.4(G2) U1.4(E)

Not connected (* = marked no-connect by the designer): U1 10(C)* 11(G)* 12(NC)* 13(H)* 14(D)*

### Buses and harness runs
bus RELAY[1..2] = port RELAY[1..2]

### Layout directives
net class DI: NetD1_1, NetD2_1

### Notes on the sheet
- Note: Use 114555P2 -staple to fasten Anderson Connectors @{"Id":"BRJWFGQJ\WWMWJHCK"}, @{"Id":"BRJWFGQJ\CGAMYHYN"}, @{"Id":"BRJWFGQJ\JTIKQCLS"}, @{"Id":"BRJWFGQJ\XEGXROSF"}  to PCB
- DWG. NO.
- REV.
- SHT.
- THIS DOCUMENT AND THE DATA DISCLOSED HEREIN OR HEREWITH IS THE PROPERTY OF ALTIUM LIMITED AND MAY BE FREELY DISTRIBUTED IN WHOLE. NO RIGHTS ARE RESERVED OR EXPRESS OR IMPLIED WARANTEE GIVEN.
- REVISION
- DESCRIPTION
- DATE
- APPROVED
- ENG:
- DSN:
- APPROVALS
- PROJECT REVISION:
- www.altium.com <http://www.altium.com>
- DOCUMENT REVISION:
- 92037, La Jolla
- USA
- Altium Ltd.
- 4225 Executive Square
- CHK:
- REFERENCE DOCUMENTS
- DESIGN ITEM:
- TITLE
- VARIANT
- BOM:
- FAB DWG:
- PCB DWG:
- ASSY DWG:
- SCALE:
- SIZE
- B
- CAGE CODE
- FILE NAME
- DWG NO.
- SHEET
- OF
- REV

### Library data of the parts
D1 D2 = CMP-004-00034-2: Single Color LED, Red, Water Clear, 1.1mm; Manufacturer: Wurth Electronics; Manufacturer Part Number: 150060RS75000; Viewing Angle: 140°; Overall Height: 0.7mm; Luminous Intensity-Nom: 250mcd; Forward Voltage: 2V; Forward Current: 30mA; Shape: Rectangular; Case/Package: 0603; Mounting Technology: Surface Mount; Pins: 2; Max Operating Temperature: 85°C; Colour: RED; Min Operating Temperature: -40°C; RoHS Compliant: Yes; Size: 1.1mm; Optoelectronic Device Type: SINGLE COLOR LED; Lens Style: WATER CLEAR; Terminal Pitch: 1.6mm; Component Type: LED; Design Item ID: CMP-007-00000-1; Diode Type: LED; Source: WCTopping - Master Project 2023-08-21.SCHLIB
DI1 DI2 = CMP-004-00032-2: Rectifier Diode, 1 Phase, 1 Element, 1A, 100V V(RRM), Silicon, DO-41; Manufacturer: ON Semiconductor; Manufacturer Part Number: MUR110RLG; Time @ Peak Reflow Temperature-Max (s): 40s; Package Body Material: Plastic; Reverse Recovery Time-Max: 0.035us; Surface Mount: No; Max Surge Current: 35A; Number of Elements: 1; Qualification Status: Not Qualified; Additional Feature: FREE WHEELING DIODE; Forward Voltage: 875mV; Diode Type: RECTIFIER; Rep Pk Reverse Voltage-Max: 100V; Package Shape: Round; JEDEC-95 Code: DO-41; RoHS Compliant: Yes; Package Style: LONG FORMMeter; Peak Reflow Temperature (Cel): 260°C; Max Output current: 1A; Diode Element Material: SILICON; JESD-609 Code: e3; Forward Current: 1A; Case/Package: Isolated; Terminal Position: AXIAL; Pins: 2; Mounting Technology: TH; Max Operating Temperature: 175°C; Terminal Finish: Tin; Terminal Form: Wire; Reach SVHC Compliant: No; JESD-30 Code: O-PALF-W2; Peak Inverse Voltage: 100V; Min Operating Temperature: -65°C; Component Type: Diodes; Design Item ID: CMP-00241-2; Source: WCTopping - Master Project 2023-08-21.SCHLIB
Q1 = CMP-022-000010-2: Small Signal Field-Effect Transistor; Manufacturer: ON Semiconductor; Manufacturer Part Number: NTHD4508NT1G; Vgs(th) (Max) @ Id: 1.2V @ 250µA; Drain Current-Max (Abs) (ID): 3.1A; Pulsed Drain Current-Max (IDM): 10A; Polarity/Channel Type: N-CHANNEL; Time @ Peak Reflow Temperature-Max (s): 30s; FET Technology: METAL-OXIDE SEMICONDUCTOR; Qualification Status: Not Qualified; Transistor Element Material: SILICON; Power Dissipation-Max (Abs): 1.13W; Drain-source On Resistance-Max: 75mR; Operating Mode: ENHANCEMENT MODE; Transistor Application: SWITCHING; DS Breakdown Voltage-Min: 20V; Number of Elements: 2; Mounting Technology: Surface Mount; Package Shape: Rectangular; Moisture Sensitivity Level: 1; Max Operating Temperature: 150°C; RoHS Compliant: No; Terminal Form: C BEND; Surface Mount: Yes; JESD-609 Code: e0; Terminal Finish: Tin; Package Style: SMALL OUTLINEMeter; Peak Reflow Temperature (Cel): 240°C; Reach SVHC Compliant: No; Pins: 8; Terminal Position: DUAL; Drain Current-Max (ID): 3.1A; Component Type: Transistors; Design Item ID: CMP-013-00000-2; Pin Count: 8; Source: WCTopping - Master Project 2023-08-21.SCHLIB
RL1 RL2 = CMP-008-00005-1: Manufacturer: Panasonic; Manufacturer Part Number: ERJ-6GEYJ102V; Tolerance: 5%; Power (Watts): 0.125W, 1/8W; Temperature Coefficient: ±200ppm/°C; RoHS: RoHS Compliant; Category: Resistors; Stock 1: 1669380; Pricing 1: 1=0.1, 50=0.015, 100=0.011, 250=0.0084, 500=0.00674, 1000=0.00496 (USD); Packaging: Cut Tape (CT); Part Status: Active; Composition: Thick Film; Features: Automotive AEC-Q200; Operating Temperature: -55°C ~ 155°C; Supplier Device Package: 0805; Size / Dimension: 0.079" L x 0.049" W (2.00mm x 1.25mm); Height: 0.028" (0.70mm); Number of Terminations: 2; Failure Rate: -; ComponentLink1URL: http://industrial.panasonic.com/www-cgi/jvcr13pz.cgi?E+PZ+3+AOA0001+ERJ6GEYJ102V+7+WW; ComponentLink1Description: http://industrial.panasonic.com/www-cgi/jvcr13pz.cgi?E+PZ+3+AOA0001+ERJ6GEYJ102V+7+WW; Case/Package: 0805 (2012 Metric); Design Item ID: Res1K_0805; Source: WCT.SchLib; Component Type: Resistors; Pins: 2
RLY1 RLY3 = CMP-022-000003-4: Anderson-1Pin RED_PCB_RHT; Also Needed Part Nr !!!: 1327; Manufacturer: Anderson Power; Manufacturer Part Number: 1377G2; Voltage Rating: 600V; Current Rating: 25A; Also Needed Description!!!: Blade Type Power Housing Connector; Approvals: ULV; Connector Support Type: CONNECTOR ACCESSORY; Design Use: Power; DIN Conformance: No; IEC Conformance: No; Material: Copper Alloy; Max Operating Temperature: 105°C; MIL Conformance: No; Min Operating Temperature: -20°C; Mounting Style: RIGHT ANGLE; Reach SVHC Compliant: Yes; RoHS Compliant: Yes; Terminal Length: 0.29inch; Termination: Solder; Voltage Rating (AC): 600V; Voltage Rating (DC): 600V; Component Type: Connectors; Design Item ID: CMP-00162-4; Pin Count: 1; Source: WCTopping - Master Project 2023-08-21.SCHLIB
RLY2 RLY4 = CMP-022-000007-5: Anderson-1Pin BLK_PCB_RHT; Also Needed Part Nr !!!: 1327G6; Manufacturer: Anderson Power; Voltage Rating: 600V; Current Rating: 25A; Also Needed Description!!!: Blade Type Power Housing Connector; Approvals: ULV; Connector Support Type: CONNECTOR ACCESSORY; Design Use: Power; DIN Conformance: No; Max Operating Temperature: 105°C; Min Operating Temperature: -20°C; RoHS Compliant: Yes; IEC Conformance: No; Material: Copper Alloy; MIL Conformance: No; Mounting Style: RIGHT ANGLE; Reach SVHC Compliant: Yes; Terminal Length: 0.29inch; Termination: Solder; Voltage Rating (AC): 600V; Voltage Rating (DC): 600V; Component Type: Connectors; Design Item ID: CMP-00198-1; Manufacturer Part Number: 1327G6; Pin Count: 1; Source: WCTopping - Master Project 2023-08-21.SCHLIB
U1 = CMP-026-000000-1: CMOS Quad Low-to-High Voltage Level Shifter, 3 to 18 V, -55 to 125 degC, 16-Pin TSSOP (PW16), RoHS, Tube; Manufacturer: Texas Instruments; Number of Bits: 4; VSS: 3 to 18 V; Propagation Delay: 240 ns Max.; Logic Function: Level Shifter, 3-State; Number of Outputs/Channel: 1; Propagation Delay (Max): 240ns; Voltage - Supply: 3 V ~ 18 V; Dynamic Catalog: 4000B; Other Names: 296-12163-6; Available Preview Images: 2D; Logic Type: BUS DRIVER; Max Supply Voltage: 18V; Min Supply Voltage: 3V; Nominal Supply Voltage: 5V; Number of Ports: 2; Output Characteristics: 3-STATE; Output Polarity: True; Package Body Material: Plastic; Propagation Delay (tpd): 600ns; Qualification Status: Not Qualified; PackageDescription: 16-Pin Plastic Small Outline Package, Body 5 x 4.4 mm, Pitch 0.65 mm; ComponentLink3URL: http://www.ti.com/lit/ml/mpds361/mpds361.pdf; Package Reference: PW0016A; ComponentLink2URL: http://www.ti.com/lit/ds/symlink/cd40109b.pdf; RoHS: TRUE; ComponentLink1URL: www.ti.com; ComponentLink1Description: Manufacturer URL; PackageVersion: 4040064-4/G; Number of Channels: 4; PartNumber: CD40109BPW; DatasheetVersion: SCHS099B; Number of Outputs: 4; ComponentLink3Description: Package Specification; ComponentLink2Description: Datasheet; Mounting Technology: Surface Mount; Packing: Tube; Temperature Range: -55 to 125 degC; Manufacturer Part Number: CD40109BPWR; Stock 1: 11025; Pricing 1: 1=0.42, 10=0.36, 100=0.2688, 500=0.2111, 1000=0.1628 (USD); Standard Package: 1; Category: Integrated Circuits (ICs); Family: Logic - Translators; Series: 4000B; Input Type: Voltage; Output Type: Voltage; Data Rate: -; Operating Temperature: -55°C ~ 125°C; Package / Case: 16-TSSOP (0.173", 4.40mm Width); Supplier Device Package: 16-TSSOP; Packaging: Digi-Reel®; ComponentLink4URL: https://datasheet.ciiva.com/1899/cd40109b-1899236.pdf; ComponentLink4Description: https://datasheet.ciiva.com/1899/cd40109b-1899236.pdf; ComponentLink5URL: https://datasheet.ciiva.com/1899/cd40109b-1899237.pdf; ComponentLink5Description: https://datasheet.ciiva.com/1899/cd40109b-1899237.pdf; ComponentLink6URL: https://datasheet.ciiva.com/1899/cd40109b-1899238.pdf; ComponentLink6Description: https://datasheet.ciiva.com/1899/cd40109b-1899238.pdf; ComponentLink7URL: https://datasheet.ciiva.com/15096/getdatasheetpartid-50246-15096137.pdf; ComponentLink7Description: https://datasheet.ciiva.com/15096/getdatasheetpartid-50246-15096137.pdf; ComponentLink8URL: https://datasheet.ciiva.com/41455/001015415-da-01-en-ic-quad-lo-hi-v-cd40109bpwr-tssop-16-tid-41455340.pdf; ComponentLink8Description: https://datasheet.ciiva.com/41455/001015415-da-01-en-ic-quad-lo-hi-v-cd40109bpwr-tssop-16-tid-41455340.pdf; ComponentLink9URL: https://datasheet.ciiva.com/3305/cd40109b-mil-3305133.pdf; ComponentLink9Description: https://datasheet.ciiva.com/3305/cd40109b-mil-3305133.pdf; Design Item ID: CD40109BPW; Source: WCT.SchLib; Case/Package: TSSOP; Channels: 1; Height - Seated (Max): 1.2mm; JESD-30 Code: R-PDSO-G16; JESD-609 Code: e4; Length: 5mm; Max Operating Temperature: 125°C; Min Operating Temperature: -55°C; Moisture Sensitivity Level: 1; Package Shape: Rectangular; Package Style: SMALL OUTLINE, THIN PROFILE, SHRINK PITCHMeter; Peak Reflow Temperature (Cel): 260°C; Pins: 16; Reach SVHC Compliant: Yes; RoHS Compliant: Yes; Surface Mount: Yes; Technology: CMOS; Temperature Grade: MILITARY; Terminal Finish: Nickel; Terminal Form: Gull Wing; Terminal Pitch: 0.65mm; Terminal Position: DUAL; Width: 4.4mm

## Sheet  Top_Level.SchDoc
size 431 x 279 mm; Organization: ORGANIZATION; Address1: ADDRESS 1; Address2: ADDRESS 2; Address3: ADDRESS 3; Address4: ADDRESS 4; Revision: -; SheetNumber: 1; SheetTotal: 8; ENG_APP_DATE: --/--/--; DSN_APP_DATE: --/--/--; CHK_APP_DATE: --/--/--
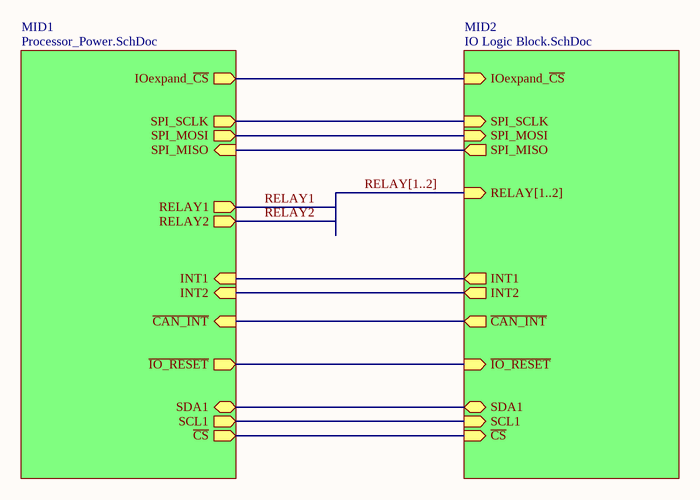
[diagram p6:  Top_Level.SchDoc]

### Sub-sheets
MID1 = Processor_Power.SchDoc (file not in this document): SDA1 (bidir), SCL1 (out), IOexpand_~{CS} (out), SPI_MOSI (out), SPI_MISO (in), SPI_SCLK (out), ~{CS} (out), RELAY1 (out), INT1 (in), RELAY2 (out), INT2 (in), ~{CAN_INT} (in), ~{IO_RESET} (out)
MID2 = IO Logic Block.SchDoc (file not in this document): RELAY[1..2] (in), ~{IO_RESET} (in), ~{CAN_INT} (out), IOexpand_~{CS} (in), SPI_SCLK (in), SPI_MOSI (in), SPI_MISO (out), INT1 (out), INT2 (out), SDA1 (bidir), SCL1 (in), ~{CS} (in)

### Nets
RELAY1: sheet MID1/RELAY1
RELAY2: sheet MID1/RELAY2
(unnamed): sheet MID1/SDA1, sheet MID2/SDA1
(unnamed): sheet MID1/SCL1, sheet MID2/SCL1
(unnamed): sheet MID1/IOexpand_~{CS}, sheet MID2/IOexpand_~{CS}
(unnamed): sheet MID1/SPI_MOSI, sheet MID2/SPI_MOSI
(unnamed): sheet MID1/SPI_MISO, sheet MID2/SPI_MISO
(unnamed): sheet MID1/SPI_SCLK, sheet MID2/SPI_SCLK
(unnamed): sheet MID1/~{CS}, sheet MID2/~{CS}
(unnamed): sheet MID1/INT1, sheet MID2/INT1
(unnamed): sheet MID1/INT2, sheet MID2/INT2
(unnamed): sheet MID1/~{CAN_INT}, sheet MID2/~{CAN_INT}
(unnamed): sheet MID1/~{IO_RESET}, sheet MID2/~{IO_RESET}

### Buses and harness runs
bus RELAY[1..2] = sheet MID2/RELAY[1..2]

### Notes on the sheet
- DWG. NO.
- REV.
- SHT.
- THIS DOCUMENT AND THE DATA DISCLOSED HEREIN OR HEREWITH IS THE PROPERTY OF ALTIUM LIMITED AND MAY BE FREELY DISTRIBUTED IN WHOLE. NO RIGHTS ARE RESERVED OR EXPRESS OR IMPLIED WARANTEE GIVEN.
- REVISION
- DESCRIPTION
- DATE
- APPROVED
- ENG:
- DSN:
- APPROVALS
- PROJECT REVISION:
- www.altium.com <http://www.altium.com>
- DOCUMENT REVISION:
- 92037, La Jolla
- USA
- Altium Ltd.
- 4225 Executive Square
- CHK:
- REFERENCE DOCUMENTS
- DESIGN ITEM:
- TITLE
- VARIANT
- BOM:
- FAB DWG:
- PCB DWG:
- ASSY DWG:
- SCALE:
- SIZE
- B
- CAGE CODE
- FILE NAME
- DWG NO.
- SHEET
- OF
- REV